# Altium project GPS_Breakout_Altium.PrjPcb
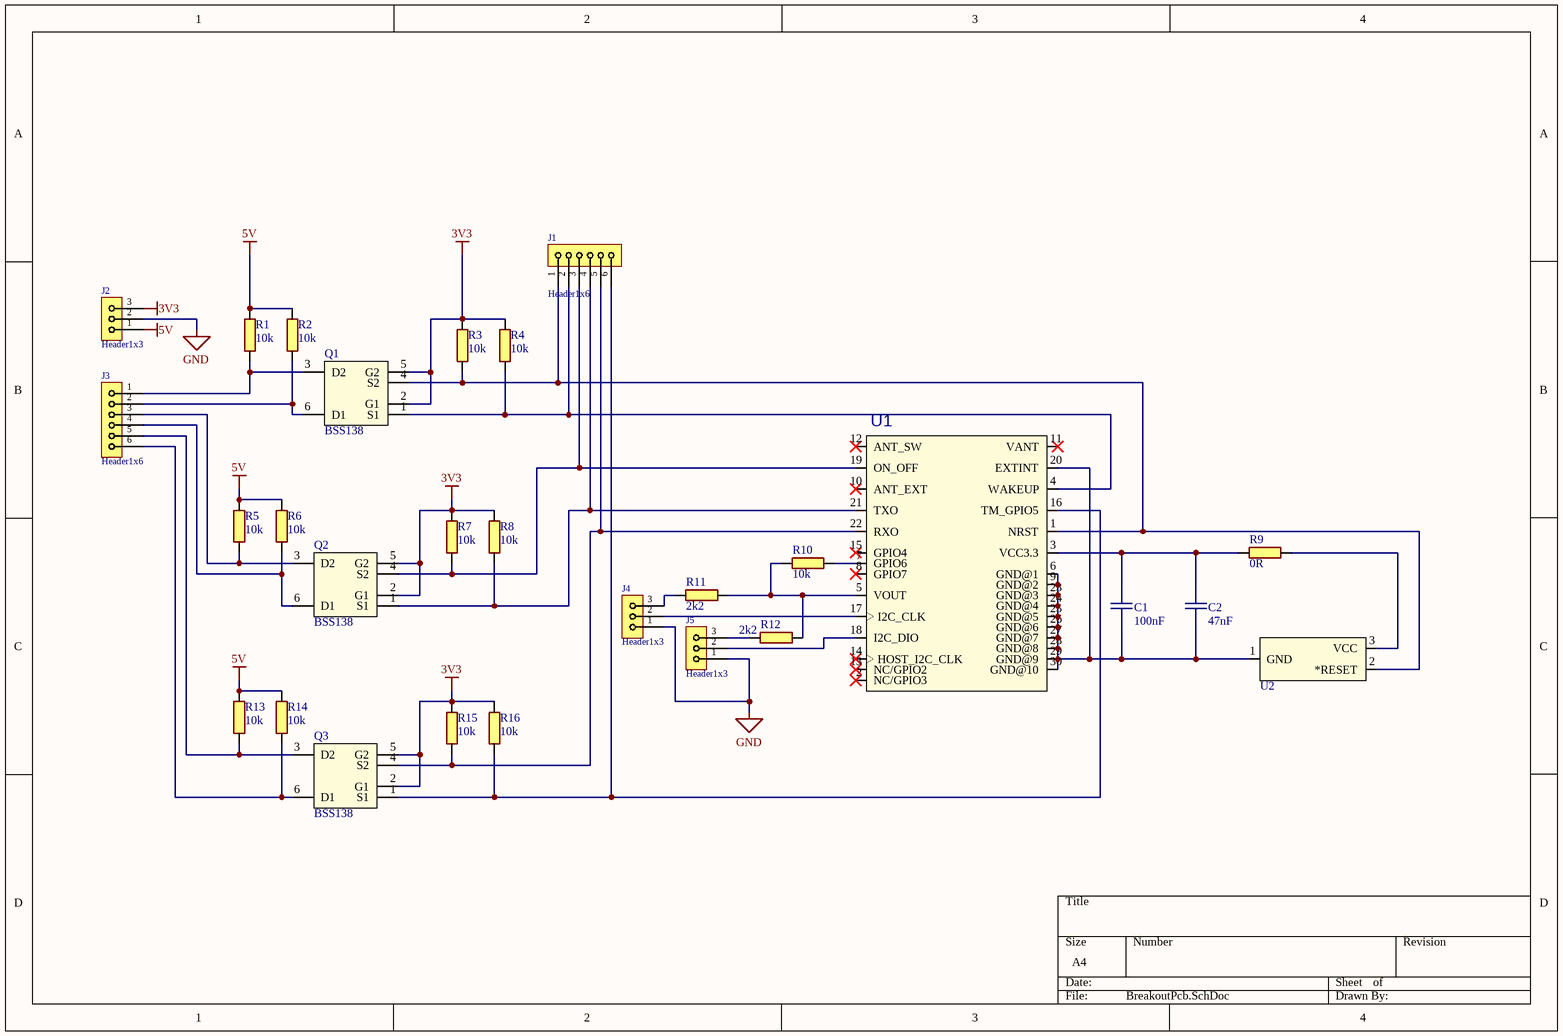
[diagram p0: BreakoutPcb.SchDoc]
1 sheet, 28 parts. Net scope: global (net labels, ports and power ports of the same name join across sheets).
Board file: BreakoutPcb.PcbDoc

## Sheet BreakoutPcb.SchDoc
size A4

### Parts
C1  100nF  [CAPC0603(1608)55_N]
C2  47nF  [CAPC0805(2012)100_N]
J1  Header1x6  [HDRV6W64P254_1X6_1524X254X900B]
J2  Header1x3  [HDRV3W64P254_1X3_762X254X900B]
J3  Header1x6  [HDRV6W64P254_1X6_1524X254X900B]
J4  Header1x3  [HDRV3W64P254_1X3_762X254X900B]
J5  Header1x3  [HDRV3W64P254_1X3_762X254X900B]
Q1  BSS138  [PCBComponent_1]
Q2  BSS138  [PCBComponent_1]
Q3  BSS138  [PCBComponent_1]
R1  10k  [RESC0603(1608)_N]
R2  10k  [RESC0603(1608)_N]
R3  10k  [RESC0603(1608)_N]
R4  10k  [RESC0603(1608)_N]
R5  10k  [RESC0603(1608)_N]
R6  10k  [RESC0603(1608)_N]
R7  10k  [RESC0603(1608)_N]
R8  10k  [RESC0603(1608)_N]
R9  0R  [RESC0603(1608)_N]
R10  10k  [RESC0603(1608)_N]
R11  2k2  [RESC0603(1608)_N]
R12  2k2  [RESC0603(1608)_N]
R13  10k  [RESC0603(1608)_N]
R14  10k  [RESC0603(1608)_N]
R15  10k  [RESC0603(1608)_N]
R16  10k  [RESC0603(1608)_N]
U1  A2235-H  [XCVR_A2235-H]  (value not drawn)
U2  MAX809SEXR-T  [21-0075D]  (value not drawn)

### Nets
3V3: J2.3 Q1.2(G1) Q1.5(G2) Q2.2(G1) Q2.5(G2) Q3.2(G1) Q3.5(G2) R3.2 R4.2 R7.2 R8.2 R15.2 R16.2
5V: J2.1 R1.2 R2.2 R5.2 R6.2 R13.2 R14.2
GND: J2.2 J4.1 J5.1
NetC1_1: C1.1 C2.1 U1.6(GND@1) U1.9(GND@2) U1.20(EXTINT) U1.23(GND@3) U1.24(GND@4) U1.25(GND@5) U1.26(GND@6) U1.27(GND@7) U1.28(GND@8) U1.29(GND@9) U1.30(GND@10) U2.1(GND)
NetC1_2: C1.2 C2.2 R9.1 U1.3(VCC3.3)
NetJ1_1: J1.1 Q1.4(S2) R3.1 U1.1(NRST) U2.2(*RESET)
NetJ1_2: J1.2 Q1.1(S1) R4.1 U1.4(WAKEUP)
NetJ1_3: J1.3 Q2.4(S2) R7.1 U1.19(ON_OFF)
NetJ1_4: J1.4 Q2.1(S1) R8.1 U1.21(TXO)
NetJ1_5: J1.5 Q3.4(S2) R15.1 U1.22(RXO)
NetJ1_6: J1.6 Q3.1(S1) R16.1 U1.16(TM_GPIO5)
NetJ3_1: J3.1 Q1.3(D2) R1.1
NetJ3_2: J3.2 Q1.6(D1) R2.1
NetJ3_3: J3.3 Q2.3(D2) R5.1
NetJ3_4: J3.4 Q2.6(D1) R6.1
NetJ3_5: J3.5 Q3.3(D2) R13.1
NetJ3_6: J3.6 Q3.6(D1) R14.1
NetJ4_2: J4.2 U1.17(I2C_CLK)
NetJ4_3: J4.3 R11.1
NetJ5_2: J5.2 U1.18(I2C_DIO)
NetJ5_3: J5.3 R12.1
NetR9_2: R9.2 U2.3(VCC)
NetR10_1: R10.1 R11.2 R12.2 U1.5(VOUT)
NetR10_2: R10.2 U1.7(GPIO6)

Not connected (* = marked no-connect by the designer): U1 2(NC/GPIO3)* 8(GPIO7)* 10(ANT_EXT)* 11(VANT)* 12(ANT_SW)* 13(NC/GPIO2)* 14(HOST_I2C_CLK)* 15(GPIO4)*

### Library data of the parts
C1 = 3028: X7R 50V 5%; id: 3028; pakke_opprettet_av: 815; pakke_opprettet: 18.02.2015 14.18.13; symbol_opprettet: 14.11.2014 20.19.34; leverandor_varenr: 1759122; pris: 1; nokkelord: Kondensator, Capacitor, CAP; produsent: Multikomp; leverandor: Farnell; pakketype: 0603; symbol_opprettet_av: 815; navn: 100nF
C2 = 2446: X7R; id: 2446; pakke_opprettet_av: 815; pakke_opprettet: 14.11.2014 20.52.01; symbol_opprettet: 14.11.2014 20.19.34; pris: 1; nokkelord: Capacitor Cap Kondis; pakketype: 0805; symbol_opprettet_av: 815; navn: 47nF
J1 J3 = 2433: id: 2433; pakke_opprettet_av: 815; pakke_opprettet: 13.11.2014 12.31.42; symbol_opprettet: 13.11.2014 11.00.26; beskrivelse: 2,54mm pitch; pris: 3; pakketype: TH; symbol_opprettet_av: 815; navn: Header 1x6
J2 J4 J5 = 2430: id: 2430; pakke_opprettet_av: 815; pakke_opprettet: 13.11.2014 12.31.03; symbol_opprettet: 13.11.2014 10.59.05; beskrivelse: 2,54mm pitch; pris: 2; pakketype: TH; symbol_opprettet_av: 815; navn: Header 1x3
Q1-Q3 = BSS138: FET SM NCH 50V 220mA SOT23-3L
R1-R8 R10 R13-R16 = 2444: 0.1W 1% Thick film resistor; id: 2444; rad: -1; rom: OV; lager_type: Fremlager; dybde: 72; hylle: 6; antall: 100; kolonne: 0; pakke_opprettet_av: 815; pakke_opprettet: 08.07.2014 21.15.30; symbol_opprettet: 08.07.2014 21.16.33; leverandor_varenr: 2447230; nokkelord: Resistor Motstand; produsent: Multikomp; leverandor: Farnell; pakketype: 0603; symbol_opprettet_av: 815; navn: 10k; pris: 0
R9 = 3186: 0.1W 1% Thick film resistor; id: 3186; pakke_opprettet_av: 815; pakke_opprettet: 08.07.2014 21.15.30; symbol_opprettet: 08.07.2014 21.16.33; pris: 0; nokkelord: Resistor Motstand Jumper Lask; produsent: Multikomp; pakketype: 0603; symbol_opprettet_av: 815; navn: 0R
R11 R12 = 3449: 0.1W 1% Thick film resistor; id: 3449; rad: -1; rom: OV; lager_type: Fremlager; dybde: 56; hylle: 6; antall: 100; kolonne: 0; pakke_opprettet_av: 815; pakke_opprettet: 08.07.2014 21.15.30; symbol_opprettet: 08.07.2014 21.16.33; pakketype: 0603; symbol_opprettet_av: 815; navn: 2k2; pris: 0
U1 = A2235-H: Gps Module, Mini Outline w/ Ant; MF: Maestro Wireless; Availability: Good; Package: None; MP: A2235-H; Price: 16.06 USD; Value: *
U2 = MAX809SEXR-T: PMIC - system monitor Maxim Integrated MAX809SEXR+T Reset/power-on reset SC 70 3; Availability: Good; Package: SC-70-3 Maxim Integrated; MP: MAX809SEXR+T; Price: 2.42 USD; MF: Maxim Integrated; Value: *